# EAGLE design bbotsv3 (EAGLE 9.6.2)
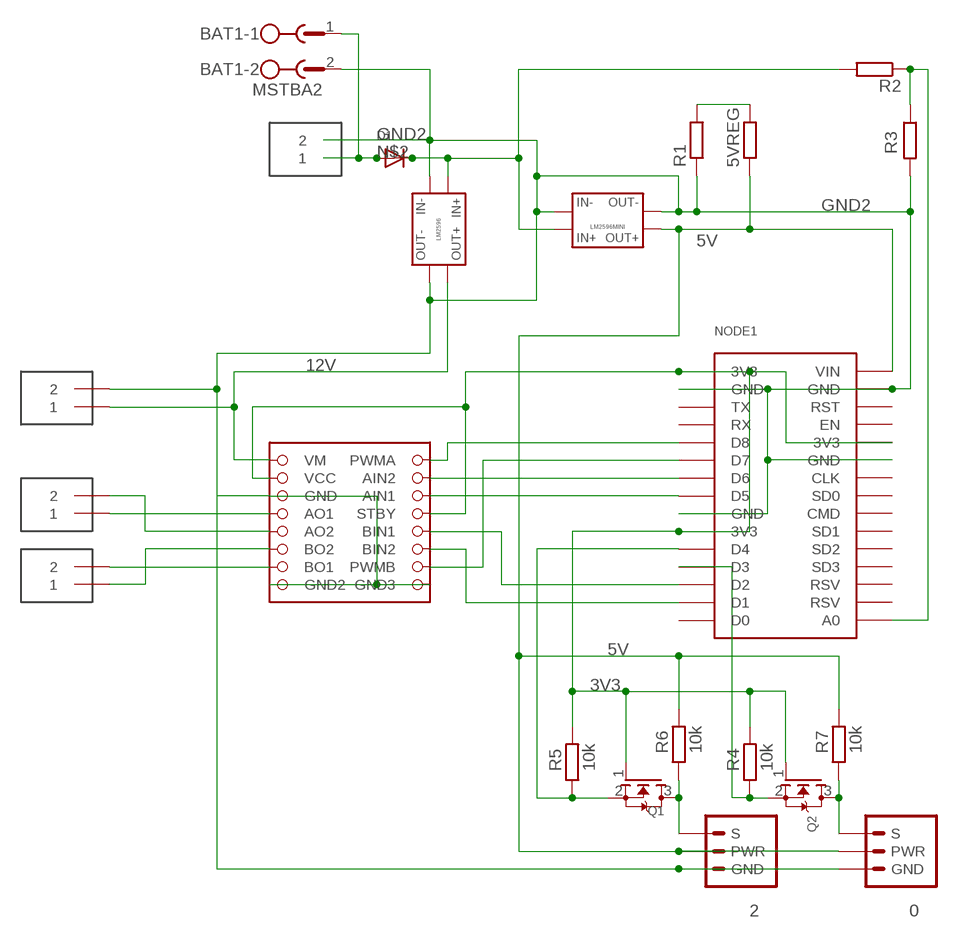
[diagram p0: schematic, sheet 1]

## Parts
0  BB-PIN3BB-PIN3  [1X03]
2  BB-PIN3BB-PIN3  [1X03]
5VREG  BB-R0805  [R0805]
ARMA  TERMINAL_2P  [KF301-2P]
ARMA1  TERMINAL_2P  [KF301-2P]
ARMA2  TERMINAL_2P  [KF301-2P]
ARMA3  TERMINAL_2P  [KF301-2P]
BAT1  MSTBA2  [MSTBA2]
D1  DIODEDO-1N4148  [DO-1N4148]
NODE1  NODEMCU_ESP8266  [NODEMCU_ESP8266]
Q1  MOSFET-NWAVE  [SOT23-W]
Q2  MOSFET-NWAVE  [SOT23-W]
R1  100  BB-R1205  [R1206]
R2  10k  BB-R1205  [R1206]
R3  1k  BB-R1205  [R1206]
R4  10k  BB-R1205  [R1206]
R5  10k  BB-R1205  [R1206]
R6  10k  BB-R1205  [R1206]
R7  10k  BB-R1205  [R1206]
U$1  BB-LM2596  [BB-LM2596]
U$2  BB-TB6612  [BB-TB6612]
U$3  BB-LM2596MINILM2596MINIV2  [LM2596MINIV2]

## Nets
3V3: NODE1.3V3@1(3V3) NODE1.3V3@2(3V3) NODE1.3V3@3(3V3) Q1.1(G) Q2.1(G) R4.2 R5.2 U$2.STBY U$2.VCC
5V: 0.P(PWR) 2.P(PWR) 5VREG.1 NODE1.VIN R6.2 R7.2 U$3.OUT+
11.1: D1.C R2.2 U$1.IN+ U$3.IN+
12V: ARMA.1 U$1.OUT+ U$2.VM
GND2: 0.GND 2.GND ARMA3.2 ARMA.2 BAT1.2 NODE1.GND@1(GND) NODE1.GND@2(GND) NODE1.GND@3(GND) NODE1.GND@4(GND) R1.1 R3.2 U$1.IN- U$1.OUT- U$2.GND U$2.GND2 U$2.GND3 U$3.IN- U$3.OUT-
N$1: NODE1.A0 R2.1 R3.1
N$2: ARMA3.1 BAT1.1 D1.A
N$3: 5VREG.2 R1.2
N$4: NODE1.D8 U$2.PWMA
N$5: NODE1.D7 U$2.PWMB
N$6: ARMA2.1 U$2.BO2
N$7: NODE1.D6 U$2.AI2(AIN2)
N$8: NODE1.D5 U$2.AI1(AIN1)
N$9: NODE1.D2 U$2.BI1(BIN1)
N$10: NODE1.D1 U$2.BI2(BIN2)
N$11: 2.S Q1.3(D) R6.1
N$12: NODE1.D3 Q2.2(S) R4.1
N$13: ARMA1.2 U$2.AO2
N$14: ARMA1.1 U$2.AO1
N$15: ARMA2.2 U$2.BO1
N$18: 0.S Q2.3(D) R7.1
N$19: NODE1.D4 Q1.2(S) R5.1
Unconnected: NODE1.CLK NODE1.CMD NODE1.D0 NODE1.EN NODE1.RST NODE1.RSV1(RSV) NODE1.RSV2(RSV) NODE1.RX NODE1.SD1 NODE1.SD2 NODE1.SD3 NODE1.SDO(SD0) NODE1.TX

## Library data of the parts
0 2 = my-library:BB-PIN3
5VREG = my-library:BB-R0805: RESISTOR, European symbol
ARMA ARMA1-ARMA3 = KF301-2P-Terminal:TERMINAL_2P: Terminal Screw 2 Port 5mm Pitch
BAT1 = con-phoenix-508:MSTBA2: PHOENIX; MF: FARNELL; MPN: 1757242; OC_FARNELL: 3705171; OC_NEWARK: 71C4161
D1 = my-library:DIODE: Diode SMADIODE - SMA Surface Mount Package 20V 1A Schottky Diode Digikey: 641-1014-6-ND DO-1N4148 - Through Hole Small Current Diode SOD-123 20V 1 A (.5mV Vf) Schottky Diode - Digikey: MBRX120TPMSCT-ND SOD-323 10V 570mA (.38mV Vf, 3ns) Schottky Diode - Digikey: ZLLS410CT-ND SOD-523 30V 30mA Schottky Diode (RB751S-40TE61) - Digikey: RB751S-40TE61CT-ND SOT23-R/W - SOT23 Package (R = Solder Paste/Reflow Ovens, W = Hand-Soldering) BAT54Film 40V 300mA - Digikey: 497-7162-1-ND
NODE1 = nodemcu_esp8266:NODEMCU_ESP8266: Node MCU V2 (ESP8266) Created by Harish
Q1 Q2 = adafruit:MOSFET-N: N-Channel Mosfet 2N7002E - 60V 260mA SOT23 [Digikey: 2N7002ET1GOSTR-ND] - REEL BSH103 - 30V 850mA SOT23 [Digikey: 568-5013-1-ND]
R1-R7 = my-library:BB-R1205
U$1 = my-library:BB-LM2596
U$2 = my-library:BB-TB6612
U$3 = my-library:BB-LM2596MINI

## Board
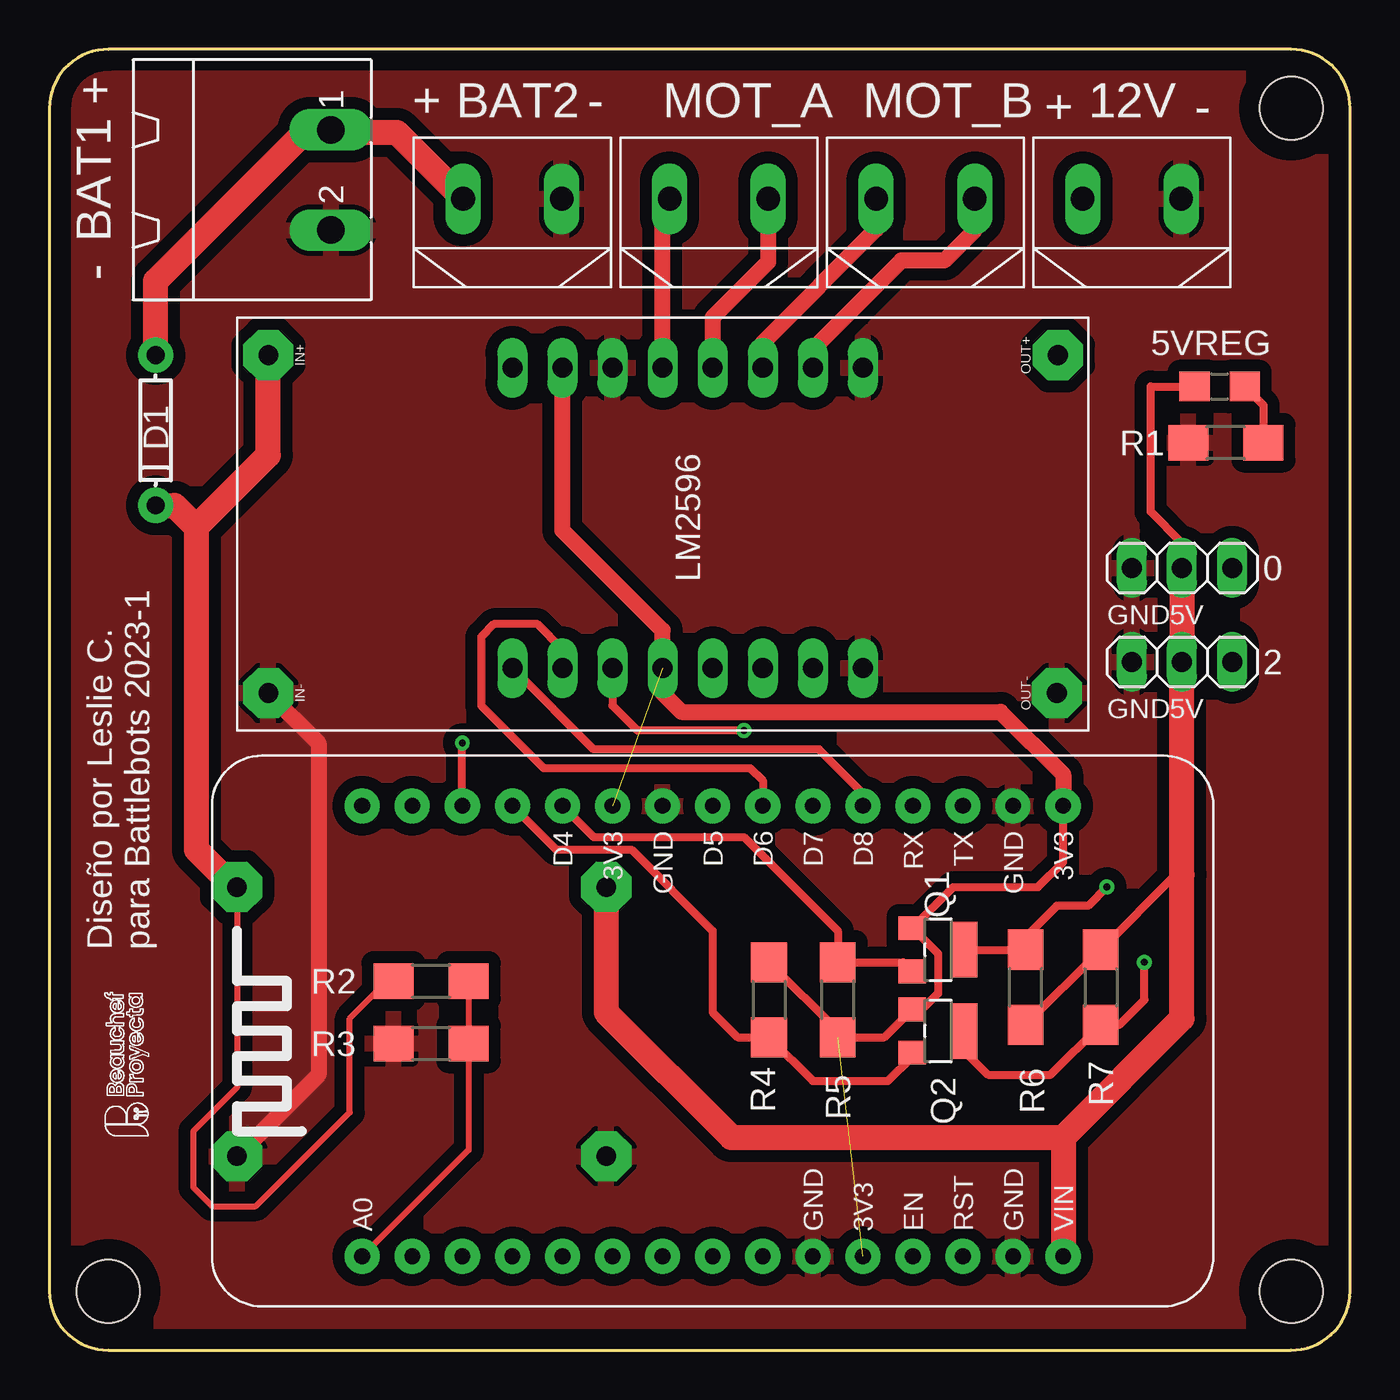
[diagram p1: board, top side]
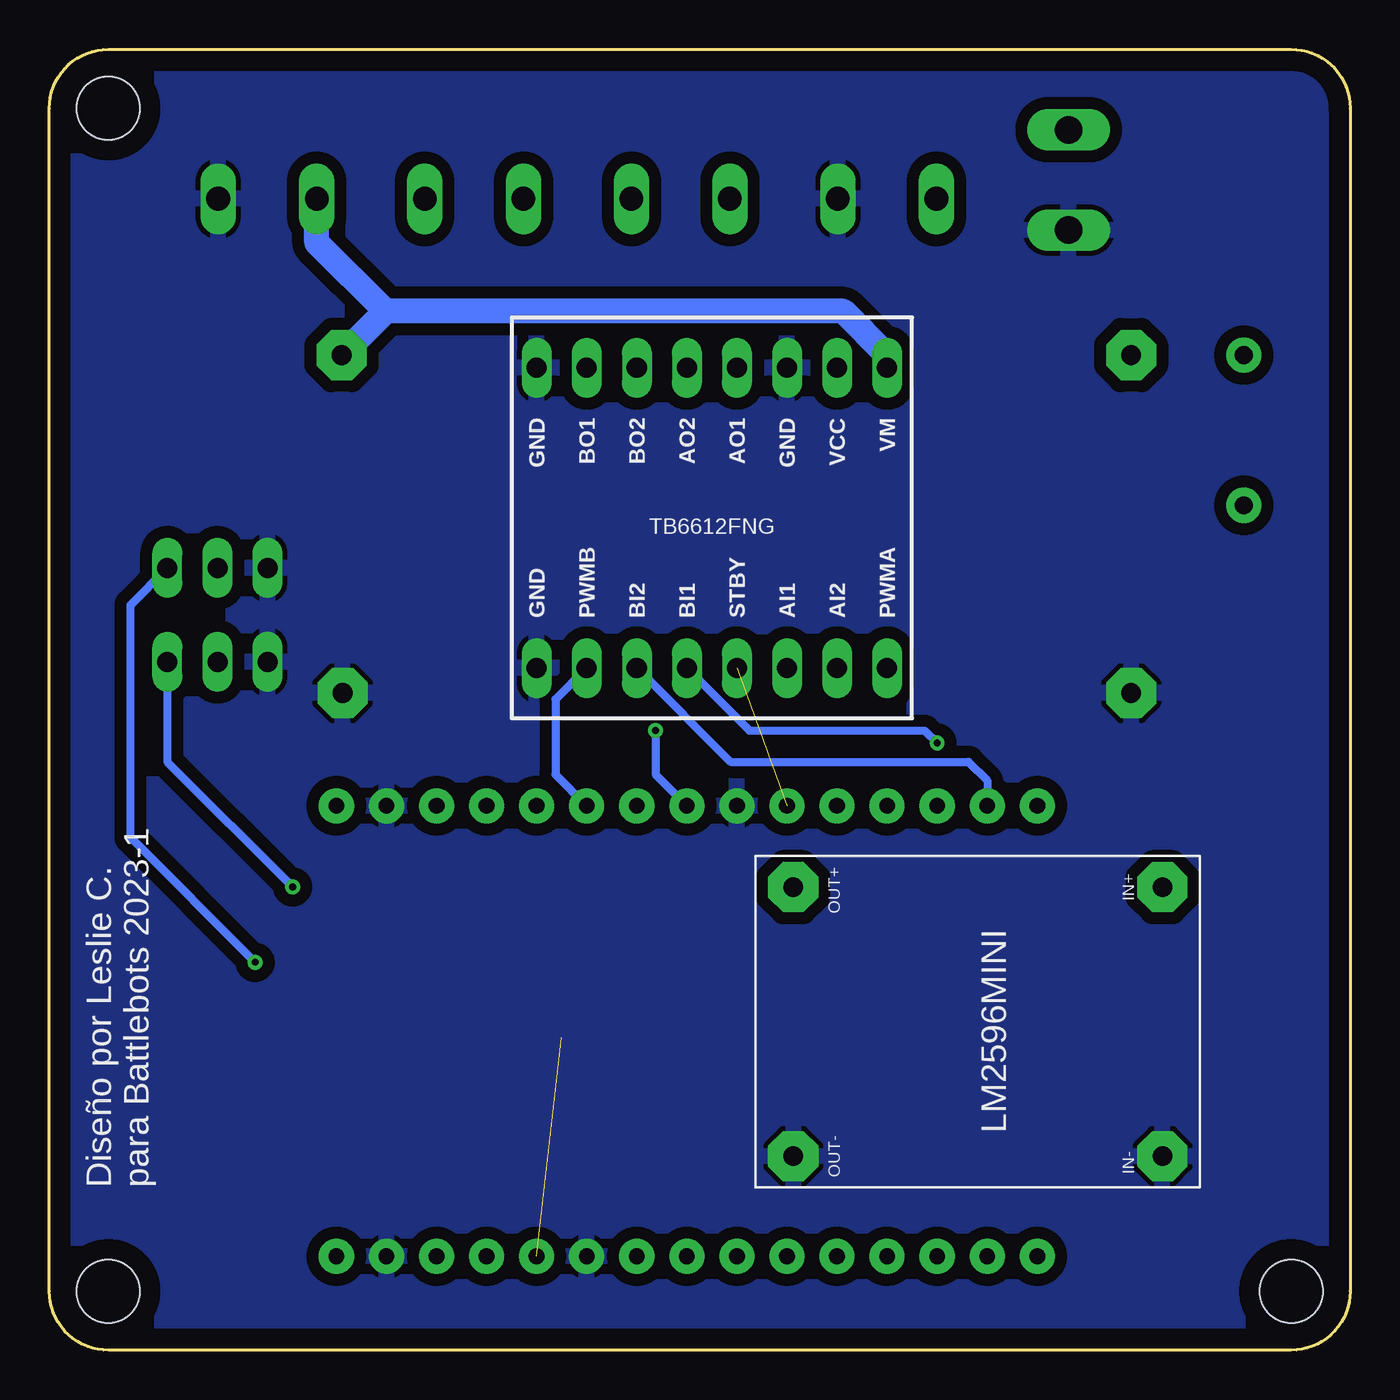
[diagram p2: board, bottom side, seen from below]

Size 66 x 66 mm. Coordinates in mm from the lower left corner, seen from the top.
Outline: 0,63 0,3 arc90 3,0 63,0 63.26,0.01 arc85 66,3 66,63 65.99,63.26 arc85 63,66 3,66 2.74,65.99 arc85 0,63
Copper layers (1*16): Top 0.035mm / dielectric 1.5mm / Bottom 0.035mm
Design rules "default": minimum track width 6mil, minimum drill 0.35mm, track to track 6mil, track to pad 6mil, pad to pad 6mil, via to via 6mil, smd to smd 6mil, copper to edge 40mil, drill to drill 6mil, minimum pad ring 10mil, minimum via ring 8mil, stop-mask expansion 4mil, vias tented up to drill 0mil, thermal gap 10mil
Holes 3.2 mm at 3,3 63,3 63,63

### Footprints (pad centres in the part's own frame; a part is rotated, then mirrored left to right if it is on the bottom)
1X03 = drill 1.016 long: GND -2.54,0; P 0,0; S 2.54,0
R0805 = smd 1.524 x 1.5: 1 -1.27,0; 2 1.27,0
KF301-2P = drill 1.2 pad 1.778 long: 1 -2.5,0; 2 2.5,0
MSTBA2 = drill 1.397 long: 1 -2.54,5.08; 2 2.54,5.08
DO-1N4148 = drill 0.9 pad 1.778: A -3.81,0; C 3.81,0
NODEMCU_ESP8266 = drill 0.8 pad 1.778: 3V3@1 -11.43,19.05; 3V3@2 -11.43,-3.81; 3V3@3 11.43,8.89; A0 11.43,-16.51; CLK 11.43,3.81; CMD 11.43,-1.27; D0 -11.43,-16.51; D1 -11.43,-13.97; D2 -11.43,-11.43; D3 -11.43,-8.89; D4 -11.43,-6.35; D5 -11.43,1.27; D6 -11.43,3.81; D7 -11.43,6.35; D8 -11.43,8.89; EN 11.43,11.43; GND@1 -11.43,16.51; GND@2 -11.43,-1.27; GND@3 11.43,6.35; GND@4 11.43,16.51; RST 11.43,13.97; RSV1 11.43,-11.43; RSV2 11.43,-13.97; RX -11.43,11.43; SD1 11.43,-3.81; SD2 11.43,-6.35; SD3 11.43,-8.89; SDO 11.43,1.27; TX -11.43,13.97; VIN 11.43,19.05
SOT23-W = smd 1.2 x 1.4: 1 -1.1,-1.3; 2 1.1,-1.3 | smd 2.8 x 1.4: 3 0,1.3
R1206 = smd 2.032 x 1.803: 1 -1.905,0; 2 1.905,0
BB-LM2596 = drill 1 pad 2.54 octagon: IN+ 1.905,1.587; IN- 19.05,1.587; OUT+ 1.905,41.643; OUT- 19.05,41.593
BB-TB6612 = drill 1.016 long: AI1 7.62,3.81; AI2 7.62,6.35; AO1 -7.62,1.27; AO2 -7.62,-1.27; BI1 7.62,-1.27; BI2 7.62,-3.81; BO1 -7.62,-6.35; BO2 -7.62,-3.81; GND -7.62,3.81; GND2 -7.62,-8.89; GND3 7.62,-8.89; PWMA 7.62,8.89; PWMB 7.62,-6.35; STBY 7.62,1.27; VCC -7.62,6.35; VM -7.62,8.89
LM2596MINIV2 = drill 1 pad 2.54 octagon: IN+ 1.587,20.637; IN- 15.24,20.637; OUT+ 1.587,1.905; OUT- 15.24,1.905

### Placement (x,y rotation side)
0  57.47,39.69 0 top
2  57.47,34.92 0 top
5VREG  59.37,48.9 0 top
ARMA  54.93,58.42 0 top
ARMA1  33.97,58.42 0 top
ARMA2  44.45,58.42 0 top
ARMA3  23.5,58.42 0 top
BAT1  9.21,59.37 270 top
D1  5.4,46.67 270 top
NODE1  32.38,16.19 270 top
Q1  45.09,20.32 270 top
Q2  45.09,16.19 270 top
R1  59.69,46.04 0 top
R2  19.37,18.73 180 top
R3  19.37,15.56 180 top
R4  36.51,17.78 90 top
R5  40.01,17.78 270 top
R6  49.53,18.41 270 top
R7  53.34,18.41 90 top
U$1  9.53,52.39 270 top
U$2  32.38,42.23 270 bottom
U$3  30.16,25.08 270 bottom

### Tracks (layer width: path | path; a pad name or v marks a point on that pad's centre or on a via)
3V3  (2 unrouted)
  Top 0.406: R4.2 40.01,16.19 R5.2 42.37,15.88 Q2.1 44.28,17.29 45.09,18.1 45.09,20.12 Q1.1 45.86,23.5 50.16,23.5 51.44,24.77 NODE1.3V3@1
  Top 0.813: NODE1.3V3@1 51.44,29.21 48.26,32.38 32.07,32.38 31.11,33.34 U$2.STBY 31.11,36.51 26.04,41.59 U$2.VCC
5V
  Top 0.406: 0.P 57.47,40.96 55.88,42.55 55.88,48.9 5VREG.1 | R6.2 R7.2 57.15,24.13 57.47,24.13
  Top 1.27: 0.P 2.P 57.47,24.13 57.47,16.83 51.44,10.79 | U$3.OUT+ 28.26,17.14 34.61,10.79 51.44,10.79 | 51.44,10.79 NODE1.VIN
11.1
  Top 0.305: U$3.IN+ 9.53,13.34 7.3,11.11 7.3,8.26 8.26,7.3 10.48,7.3 15.24,12.06 15.24,16.83 17.14,18.73 R2.2
  Top 0.813: 9.37,23.5 U$3.IN+
  Top 1.27: 9.37,23.5 7.46,25.4 7.46,41.75 | 7.46,41.75 11.11,45.4 U$1.IN+ | D1.C 6.35,42.86 7.46,41.75
12V
  Bottom 1.27: U$2.VM 23.5,50.48 25.72,52.7 48.95,52.7 | U$1.OUT+ 48.95,52.7 | 48.95,52.7 52.43,56.19 ARMA.1
GND2
  Top 0.813: U$1.IN- 13.65,30.8 13.65,13.97 U$3.IN-
  pour Top (isolate 0.61): 0,0.32 65.79,0.32 66.04,0.57 66.04,66.04 0.25,66.04 0,65.79
  pour Bottom (isolate 0.61): 0.32,0.32 65.47,0.32 65.72,0.57 65.72,66.04 0.57,66.04 0.32,65.79
N$1
  Top 0.305: NODE1.A0 21.27,10.16 R3.1 R2.1
N$2
  Top 0.813: BAT1.1 14.29,61.77
  Top 1.27: ARMA3.1 17.64,61.77 14.29,61.77 12.92,61.77 5.4,54.24 D1.A
N$3
  Top 0.406: 5VREG.2 61.59,47.94 R1.2
N$4
  Top 0.406: U$2.PWMA 27.62,30.48 39.05,30.48 41.27,28.26 NODE1.D8
N$5
  Bottom 0.406: U$2.PWMB 40.32,33.02 40.32,29.21 NODE1.D7
N$6
  Top 0.813: ARMA2.1 41.95,56.87 36.2,51.12 U$2.BO2
N$7
  Top 0.406: U$2.AI2 26.04,35.56 24.77,36.83 22.54,36.83 21.91,36.2 21.91,32.7 25.08,29.53 35.56,29.53 36.2,28.89 NODE1.D6
N$8  (via drill 0.35)
  Top 0.406: U$2.AI1 28.57,32.7 29.84,31.43 v35.24,31.43
  Bottom 0.406: NODE1.D5 35.24,29.21 v35.24,31.43
N$9  (via drill 0.35)
  Top 0.406: NODE1.D2 v20.95,30.8
  Bottom 0.406: U$2.BI1 30.48,31.43 21.59,31.43 v20.95,30.8
N$10
  Bottom 0.406: U$2.BI2 31.43,29.84 19.37,29.84 18.41,28.89 NODE1.D1
N$11  (via drill 0.35)
  Top 0.406: Q1.3 R6.1 49.53,20.95 51.12,22.54 52.7,22.54 v53.66,23.5
  Bottom 0.406: 2.S 60.01,29.84 v53.66,23.5
N$12
  Top 0.406: NODE1.D3 25.72,25.4 29.53,25.4 33.66,21.27 33.66,17.14 34.92,15.88 R4.1 38.73,13.65 42.55,13.65 43.78,14.89 Q2.2
N$13
  Top 0.813: 33.66,50.85 U$2.AO2 33.66,52.39 36.47,55.2 ARMA1.2
N$14
  Top 0.813: U$2.AO1 31.11,58.42 ARMA1.1
N$15
  Top 0.813: U$2.BO1 38.73,50.8 43.22,55.28 45.4,55.28 46.95,56.83 ARMA2.2
N$18  (via drill 0.35)
  Top 0.406: Q2.3 46.38,15.21 47.62,13.97 50.8,13.97 R7.1 54.29,16.51 55.56,17.78 v55.56,19.68
  Bottom 0.406: v55.56,19.68 61.88,26 61.88,37.81 0.S
N$19
  Top 0.406: NODE1.D4 27.62,26.04 35.24,26.04 40.01,21.27 R5.1 43.32,19.68 Q1.2

### Text on the board
tPlace: + | + | BAT2 | - | MOT_A | MOT_B | 12V | + | - | - | GND | 5V | GND | 5V | Diseño por Leslie C. / para Battlebots 2023-1
bPlace: Diseño por Leslie C. / para Battlebots 2023-1